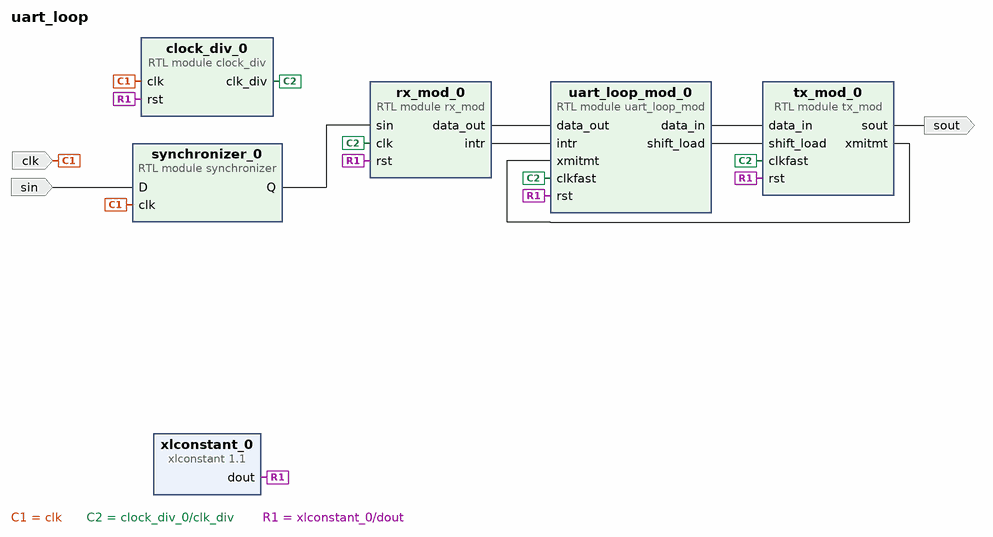
[diagram p0: block diagram of the top level]
# Vivado block design uart_loop, xc7z020clg400-1, Vivado 2023.2
create_bd_design uart_loop

create_bd_port -dir O sout
create_bd_port -dir I sin
create_bd_port -dir I -type clk clk

create_bd_cell -type module -reference rx_mod rx_mod_0
create_bd_cell -type module -reference tx_mod tx_mod_0
create_bd_cell -type module -reference uart_loop_mod uart_loop_mod_0
create_bd_cell -type module -reference synchronizer synchronizer_0
create_bd_cell -type ip -vlnv xilinx.com:ip:xlconstant:1.1 xlconstant_0
set_property -dict {CONFIG.CONST_VAL 0} [get_bd_cells xlconstant_0]
create_bd_cell -type module -reference clock_div clock_div_0
set_property -dict {CONFIG.half_val 407 CONFIG.n_bits 10} [get_bd_cells clock_div_0]

# ---- connections ----

connect_bd_net -net clk_0_1 [get_bd_ports clk] [get_bd_pins synchronizer_0/clk] [get_bd_pins clock_div_0/clk]
connect_bd_net [get_bd_pins clock_div_0/clk_div] [get_bd_pins rx_mod_0/clk] [get_bd_pins uart_loop_mod_0/clkfast] [get_bd_pins tx_mod_0/clkfast]
connect_bd_net [get_bd_pins rx_mod_0/data_out] [get_bd_pins uart_loop_mod_0/data_out]
connect_bd_net [get_bd_pins rx_mod_0/intr] [get_bd_pins uart_loop_mod_0/intr]
connect_bd_net -net sin_0_1 [get_bd_ports sin] [get_bd_pins synchronizer_0/D]
connect_bd_net [get_bd_pins synchronizer_0/Q] [get_bd_pins rx_mod_0/sin]
connect_bd_net [get_bd_pins tx_mod_0/sout] [get_bd_ports sout]
connect_bd_net [get_bd_pins tx_mod_0/xmitmt] [get_bd_pins uart_loop_mod_0/xmitmt]
connect_bd_net [get_bd_pins uart_loop_mod_0/data_in] [get_bd_pins tx_mod_0/data_in]
connect_bd_net [get_bd_pins uart_loop_mod_0/shift_load] [get_bd_pins tx_mod_0/shift_load]
connect_bd_net [get_bd_pins xlconstant_0/dout] \
  [get_bd_pins uart_loop_mod_0/rst] [get_bd_pins rx_mod_0/rst] [get_bd_pins tx_mod_0/rst] [get_bd_pins clock_div_0/rst]

validate_bd_design
save_bd_design
